# EAGLE design Bee Stem v0.9b (EAGLE 5.10)
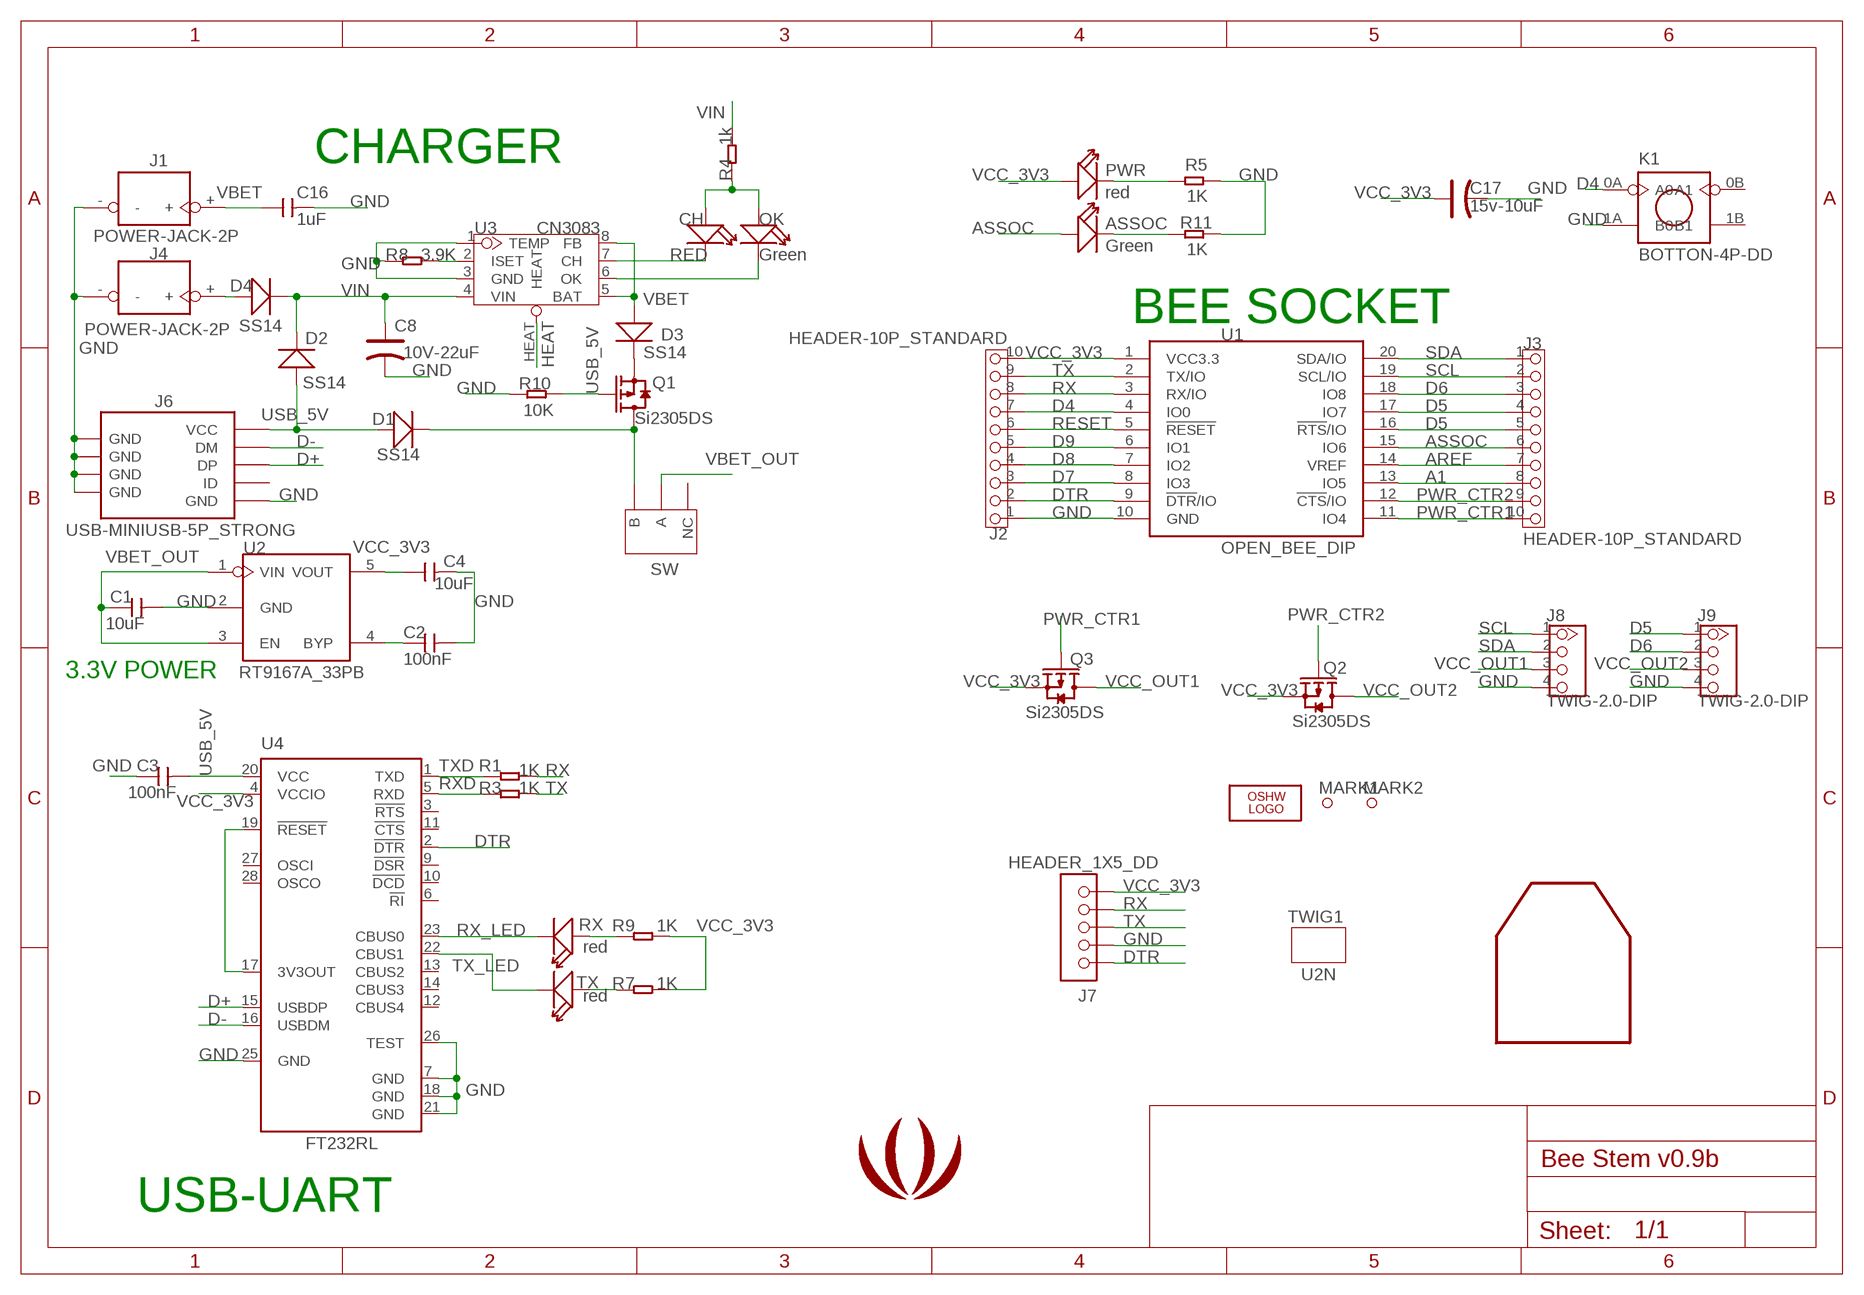
[diagram p0: schematic, sheet 1]

## Parts
ASSOC  Green  LED-0603  [D0603]
C1  10uF  C-0805  [0805]
C2  100nF  C-0603  [0603]
C3  100nF  C-0603  [0603]
C4  10uF  C-0805  [0805]
C8  10V-22uF  CAP_AVX_B  [AVX-B]
C16  1uF  C-0805  [0805]
C17  15v-10uF  CAP_AVX_A  [AVX-A]
CH  RED  LED-0603  [D0603]
D1  SS14  D-2010  [D2010]
D2  SS14  D-2010  [D2010]
D3  SS14  D-2010  [D2010]
D4  SS14  D-2010  [D2010]
J1  POWER-JACK-2P  JACK-2P_180  [POWER-JACK-2P]
J2  HEADER-10P_STANDARD  [2.54_10P]
J3  HEADER-10P_STANDARD  [2.54_10P]
J4  POWER-JACK-2P  JACK-2P_180  [POWER-JACK-2P]
J6  USB-MINIUSB-5P_STRONG  [MINI_STRONG]
J7  HEADER_1X5_DD  [CK_1X5]
J8  TWIG-2.0-DIP  [2.0_1X4]
J9  TWIG-2.0-DIP  [2.0_1X4]
K1  BOTTON-4P-DD  [BTN-S]
LOGO1  LOGO_SILK  [LOGO_SILK]
LOGO2  OSHW_LOGO_FILLX0200-NT  [OSHW_FILLX200_NOTEXT]
MARK1  PAD-MARK  [MARK]
MARK2  PAD-MARK  [MARK]
OK  Green  LED-0603  [D0603]
PWR  red  LED-0805  [D0805]
Q1  Si2305DS  010-P-MOSFETSOT23  [SOT23]
Q2  Si2305DS  010-P-MOSFETSOT23  [SOT23]
Q3  Si2305DS  010-P-MOSFETSOT23  [SOT23]
R1  1K  R-0603  [0603]
R3  1K  R-0603  [0603]
R4  1k  R-0603  [0603]
R5  1K  R-0603  [0603]
R7  1K  R-0603  [0603]
R8  3.9K  R-0603  [0603]
R9  1K  R-0603  [0603]
R10  10K  R-0603  [0603]
R11  1K  R-0603  [0603]
RX  red  LED-0603  [D0603]
SW  SWITCH-3P  [008-SW-3P-DIP]
TWIG1  U2N  [U2N_SILK]
TX  red  LED-0603  [D0603]
U1  OPEN_BEE_DIP  [CCBEE-PRO]
U2  RT9167A_33PB  RT9167A  [SOT23-5]
U3  CN3083  [SOP8]
U4  FT232RL  [SSOP28]
U$1  WIFI_SILK  [WIFI_SILK]

## Nets
A1: J3.8 U1.13(IO5)
AREF: J3.7 U1.14(VREF)
ASSOC: ASSOC.+ J3.6 U1.15(IO6)
D4: J2.7 K1.0A(A0) U1.4(IO0)
D5: J3.4 J3.5 J9.1 U1.16(!RTS!/IO) U1.17(IO7)
D6: J3.3 J9.2 U1.18(IO8)
D7: J2.3 U1.8(IO3)
D8: J2.4 U1.7(IO2)
D9: J2.5 U1.6(IO1)
D+: J6.3(DP) U4.15(USBDP)
D-: J6.2(DM) U4.16(USBDM)
DTR: J2.2 J7.1 U1.9(!DTR!/IO) U4.2(!DTR)
GND: C1.2 C2.2 C3.1 C4.2 C8.- C16.2 C17.- J1.- J2.1 J4.- J6.5(GND) J6.GND@1(GND) J6.GND@2(GND) J6.GND@3(GND) J6.GND@4(GND) J7.2 J8.4 J9.4 K1.1A(B0) R5.1 R8.1 R10.1 R11.1 U1.10(GND) U2.2(GND) U3.1(TEMP) U3.3(GND) U4.7(GND) U4.18(GND) U4.21(GND) U4.25(GND) U4.26(TEST)
HEAT: U3.HEAT
N$1: PWR.- R5.2
N$2: R8.2 U3.2(ISET)
N$3: D4.+ J4.+
N$6: C2.1 U2.4(BYP)
N$7: CH.- U3.7(CH)
N$8: OK.- U3.6(OK)
N$9: CH.+ OK.+ R4.1
N$10: U4.17(3V3OUT) U4.19(!RESET)
N$11: D3.- Q1.2(S)
N$12: ASSOC.- R11.2
N$13: D1.- Q1.3(D) SW.P$3(B)
N$15: R9.1 RX.+
N$16: R7.1 TX.+
PWR_CTR1: J3.10 Q3.1(G) U1.11(IO4)
PWR_CTR2: J3.9 Q2.1(G) U1.12(!CTS!/IO)
RESET: J2.6 U1.5(!RESET)
RX: J2.8 J7.4 R1.2 U1.3(RX/IO)
RX_LED: RX.- U4.23(CBUS0)
RXD: R3.1 U4.5(RXD)
SCL: J3.2 J8.1 U1.19(SCL/IO)
SDA: J3.1 J8.2 U1.20(SDA/IO)
TX: J2.9 J7.3 R3.2 U1.2(TX/IO)
TX_LED: TX.- U4.22(CBUS1)
TXD: R1.1 U4.1(TXD)
USB_5V: C3.2 D1.+ D2.+ J6.1(VCC) Q1.1(G) R10.2 U4.20(VCC)
VBET: C16.1 D3.+ J1.+ U3.5(BAT) U3.8(FB)
VBET_OUT: C1.1 SW.P$2(A) U2.1(VIN) U2.3(EN)
VCC_3V3: C4.1 C17.+ J2.10 J7.5 PWR.+ Q2.2(S) Q3.2(S) R7.2 R9.2 U1.1(VCC3.3) U2.5(VOUT) U4.4(VCCIO)
VCC_OUT1: J8.3 Q3.3(D)
VCC_OUT2: J9.3 Q2.3(D)
VIN: C8.+ D2.- D4.- R4.2 U3.4(VIN)
Unconnected: J6.4(ID) K1.0B(A1) K1.1B(B1) SW.P$1(NC) U4.3(!RTS) U4.6(!RI) U4.9(!DSR) U4.10(!DCD) U4.11(!CTS) U4.12(CBUS4) U4.13(CBUS2) U4.14(CBUS3) U4.27(OSCI) U4.28(OSCO)

## Notes on the sheet
- CHARGER
- BEE SOCKET
- 3.3V POWER
- USB-UART

## Library data of the parts
ASSOC CH OK PWR RX TX = Discrete:LED*
C1-C4 C16 = Discrete:C*: Ceramic Capacitors
C8 C17 = Discrete:CAP*: Electrolytic Capacitors,Tantalum Capacitors and Super Capacitors
D1-D4 = Discrete:D*
J1 J4 = Connector:JACK-2P
J2 J3 = Connector:HEADER-10P
J6 = Connector:USB-MINIUSB-5P
J7 = CONNECTER:HEADER_1X5
J8 J9 = Connector:TWIG-2.0-DIP
K1 = Discrete:BOTTON-4P
LOGO1 = logo:LOGO_SILK
LOGO2 = logo:OSHW_LOGO_FILL
MARK1 MARK2 = Discrete:PAD-MARK
Q1-Q3 = Discrete:010-P-MOSFET*: Si2305DS Si2323CDS
R1 R3-R5 R7-R11 = Discrete:R*
SW = Discrete:SWITCH-3P
TWIG1 = twig_template1:U2N
U1 = EXT_moudle:OPEN_BEE
U2 = IC:RT9167A: Voltage regulator
U3 = IC:CN3083
U4 = IC:FT232R: Source: http://www.ftdichip.com/Documents/DataSheets/DS_FT232R_v104.pdf
U$1 = seeedleo:WIFI_SILK

## Net classes
0 default: width 0.203 mm, drill 0.305 mm, clearance 0.127 mm

## Board
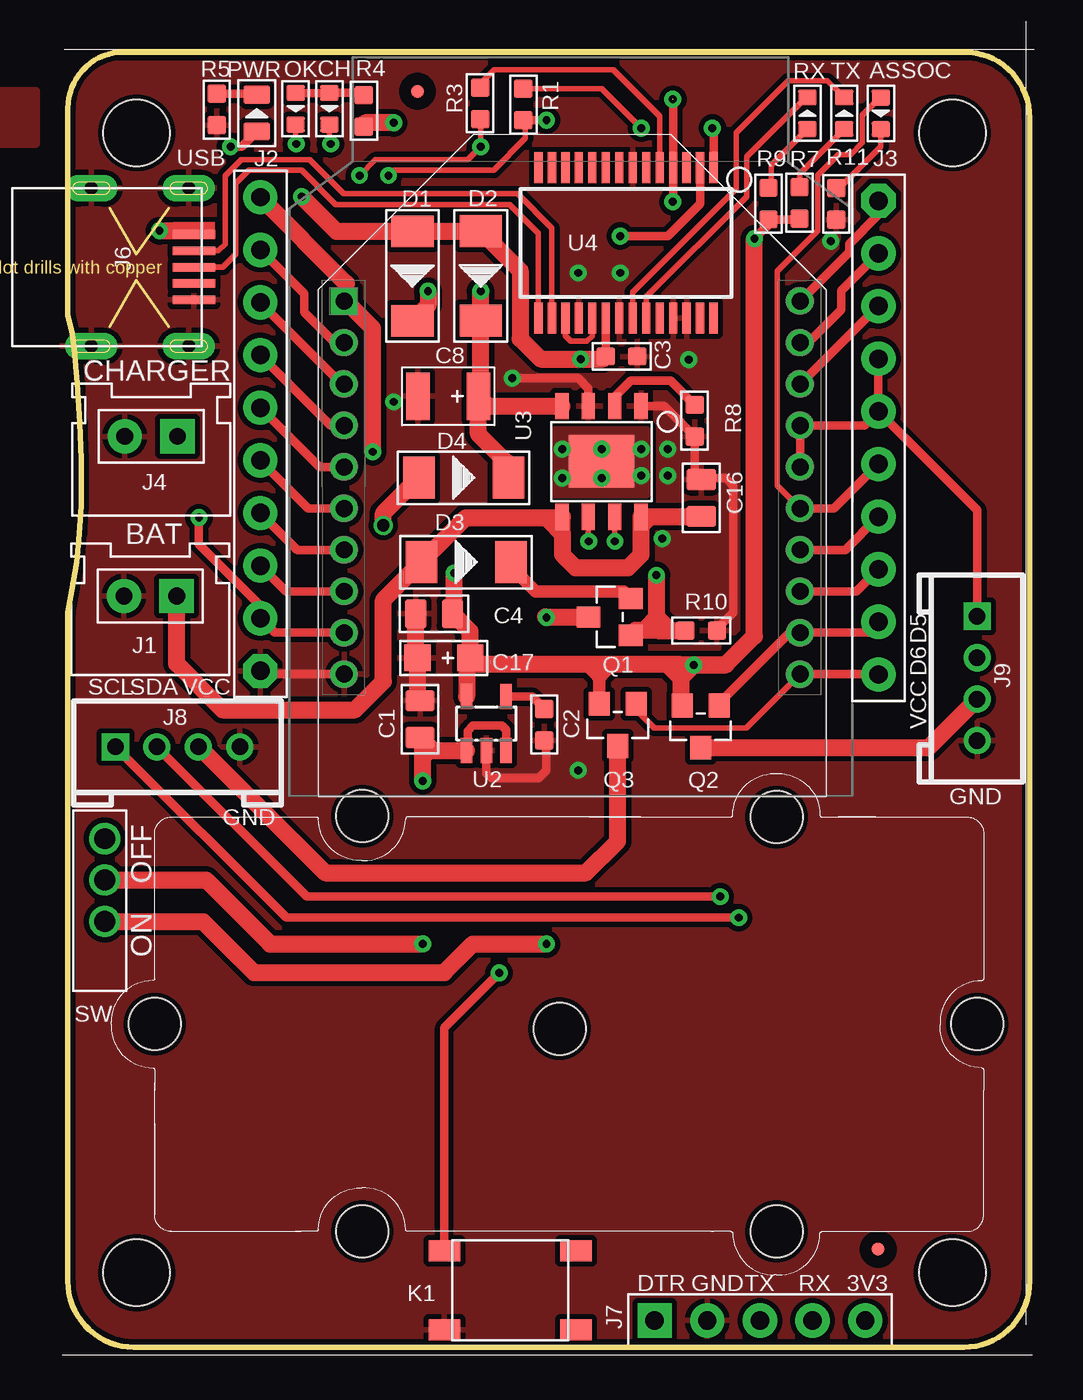
[diagram p1: board, top side]
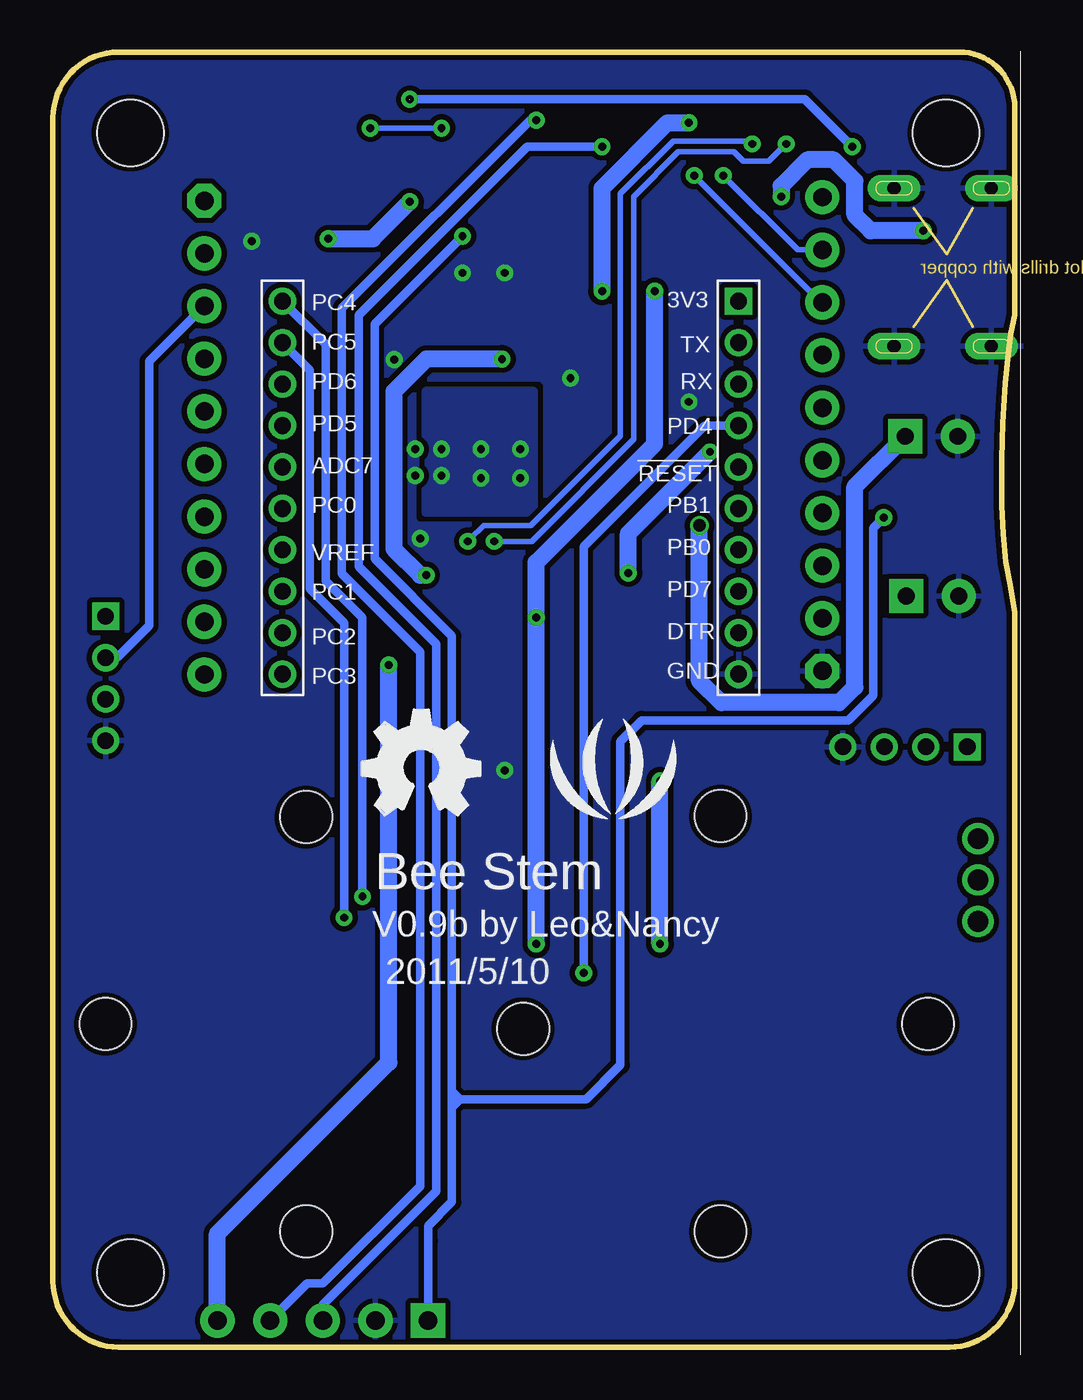
[diagram p2: board, bottom side, seen from below]

Size 46.48 x 62.53 mm. Coordinates in mm from the lower left corner, seen from the top.
Outline: 0.03,49.83 0.03,59.82 arc-90 2.73,62.53 43.25,62.53 arc-90 46.43,59.35 46.43,3.2 arc-90 43.25,0.03 3.2,0.03 arc-90 0.03,3.2 0.03,35.46 0.48,38.05 0.71,41.05 0.58,45.69 0.25,48.89 0.03,49.83
Outline: 46.48,59.46 arc67 43.79,62.53
Outline: 0,3.07 arc67 2.69,0
Outline: 43.38,0 arc67 46.46,2.69
Outline: 0.03,35.48 0.25,36.8 0.46,37.92 0.58,39.27 0.66,40.64 0.66,42.87 0.61,44.63 0.48,46.56 0.33,48.16 0.23,48.95 0.03,49.83
Copper layers (1*16): Top 0.035mm / dielectric 1.5mm / Bottom 0.035mm
Design rules "SeeedStudio_rule_no_angle_090911": minimum track width 6mil, minimum drill 12mil, track to track 6mil, track to pad 6mil, pad to pad 6mil, via to via 6mil, smd to smd 0mil, copper to edge 10mil, drill to drill 10mil, minimum pad ring 10mil, minimum via ring 6mil, stop-mask expansion 2mil, vias tented up to drill 100mil, thermal gap 10mil
Holes 3.2 mm at 42.69,58.62 42.69,3.62 3.35,3.62 3.35,58.62
Holes 2.5 mm at 43.89,15.62 14.22,25.65 34.21,25.6 23.75,15.39 14.22,5.61 4.22,15.62 34.21,5.61

### Footprints (pad centres in the part's own frame; a part is rotated, then mirrored left to right if it is on the bottom)
D0603 = smd 0.762 x 0.889: + -0.762,0; - 0.762,0
0805 = smd 1.016 x 1.397: 1 -0.889,0; 2 0.889,0
0603 = smd 0.889 x 0.889: 1 -0.762,0; 2 0.762,0
AVX-B = smd 1.143 x 2.286: + -1.46,0; - 1.46,0
AVX-A = smd 1.27 x 1.27: + -1.27,0; - 1.27,0
D2010 = smd 1.524 x 2.032: + -2.159,0; - 2.159,0
POWER-JACK-2P = drill 0.813 pad 1.651 square: + 1.27,0 | drill 0.813 pad 1.651 round: - -1.27,0
2.54_10P = drill 0.889 pad 1.651 octagon: 1 0,11.43 | drill 0.889 pad 1.651 round: 2 0,8.89; 3 0,6.35; 4 0,3.81; 5 0,1.27; 6 0,-1.27; 7 0,-3.81; 8 0,-6.35; 9 0,-8.89; 10 0,-11.43
MINI_STRONG = smd 2.032 x 0.406: 1 0.381,-1.575; 2 0.381,-0.787; 3 0.381,0; 4 0.381,0.787; 5 0.381,1.575 | drill 0.635 pad 1.27 long: GND@1 0.635,3.81; GND@2 5.334,3.81; GND@3 5.334,-3.81; GND@4 0.635,-3.81
CK_1X5 = drill 0.889 pad 1.651 square: 1 0,5.08 | drill 0.889 pad 1.651 round: 2 0,2.54; 3 0,0; 4 0,-2.54; 5 0,-5.08
2.0_1X4 = drill 0.8 pad 1.27 square: 1 -3,0 | drill 0.8 pad 1.27 round: 2 -1,0; 3 1,0; 4 3,0
BTN-S = smd 1.524 x 1.016: 0A -3.175,1.905; 0B 3.175,1.905; 1A -3.175,-1.905; 1B 3.175,-1.905
MARK = smd 0.635 x 0.635: P$1 0,0
D0805 = smd 0.889 x 1.27: + -0.889,0; - 0.889,0
SOT23 = smd 1.016 x 1.143: 1 -0.889,-1.016; 2 0.889,-1.016; 3 0,1.016
008-SW-3P-DIP = drill 1 pad 1.5 round: P$1 -3,0.24; P$2 -1,0.24; P$3 1,0.24
CCBEE-PRO = drill 0.813 square: 1 -11,9 | drill 0.813 round: 2 -11,7; 3 -11,5; 4 -11,3; 5 -11,1; 6 -11,-1; 7 -11,-3; 8 -11,-5; 9 -11,-7; 10 -11,-9; 11 11,-9; 12 11,-7; 13 11,-5; 14 11,-3; 15 11,-1; 16 11,1; 17 11,3; 18 11,5; 19 11,7; 20 11,9
SOT23-5 = smd 0.55 x 1.2: 1 -0.95,-1.3; 2 0,-1.3; 3 0.95,-1.3; 4 0.95,1.3; 5 -0.95,1.3
SOP8 = smd 0.635 x 1.27: 1 -1.905,-2.667; 2 -0.635,-2.667; 3 0.635,-2.667; 4 1.905,-2.667; 5 1.905,2.667; 6 0.635,2.667; 7 -0.635,2.667; 8 -1.905,2.667 | smd 3.175 x 2.54: HEAT 0,0
SSOP28 = smd 0.4 x 1.5: 1 -4.225,-3.625; 2 -3.575,-3.625; 3 -2.925,-3.625; 4 -2.275,-3.625; 5 -1.625,-3.625; 6 -0.975,-3.625; 7 -0.325,-3.625; 8 0.325,-3.625; 9 0.975,-3.625; 10 1.625,-3.625; 11 2.275,-3.625; 12 2.925,-3.625; 13 3.575,-3.625; 14 4.225,-3.625; 15 4.225,3.625; 16 3.575,3.625; 17 2.925,3.625; 18 2.275,3.625; 19 1.625,3.625; 20 0.975,3.625; 21 0.325,3.625; 22 -0.325,3.625; 23 -0.975,3.625; 24 -1.625,3.625; 25 -2.275,3.625; 26 -2.925,3.625; 27 -3.575,3.625; 28 -4.225,3.625

### Placement (x,y rotation side)
ASSOC  39.24,59.56 270 top
C1  17.01,30.33 90 top
C2  23.01,30.07 270 top
C3  26.74,47.84 180 top
C4  17.7,35.42 180 top
C8  18.37,45.91 180 top
C16  30.58,41 90 top
C17  18.16,33.29 180 top
CH  12.64,59.79 270 top
D1  16.65,51.72 270 top
D2  19.94,51.72 270 top
D3  19.24,37.91 0 top
D4  19.12,41.98 0 top
J1  4,36.27 0 top
J2  9.31,44.09 180 top
J3  39.13,43.91 0 top
J4  4.04,43.97 0 top
J6  6.49,52.14 180 top
J7  33.41,1.32 90 top
J8  5.32,29 0 top
J9  43.89,32.29 270 top
K1  21.36,2.77 0 top
LOGO1  19.42,27.19 0 bottom
LOGO2  31.5,25.7 0 bottom
MARK1  39.12,4.75 0 top
MARK2  16.89,60.63 0 top
OK  11.01,59.78 270 top
PWR  9.14,59.58 90 top
Q1  26.16,35.27 90 top
Q2  30.55,29.97 180 top
Q3  26.55,30.05 180 top
R1  22,59.99 270 top
R3  19.91,60.05 270 top
R4  14.31,59.68 270 top
R5  7.21,59.75 90 top
R7  35.32,55.24 270 top
R8  30.26,44.73 90 top
R9  33.82,55.21 270 top
R10  30.57,34.61 180 top
R11  37.09,55.19 90 top
RX  35.7,59.57 90 top
SW  1.56,21.57 270 top
TWIG1  24.38,15.39 0 top
TX  37.47,59.57 90 top
U1  24.36,41.5 0 top
U2  20.21,30.12 0 top
U3  25.77,42.77 180 top
U4  26.95,53.31 180 top
U$1  24.48,41.17 0 top

### Tracks (layer width: path | path; a pad name or v marks a point on that pad's centre or on a via)
A1
  Top 0.406: U1.13 38.06,36.5 J3.8
AREF
  Top 0.406: U1.14 37.52,38.5 J3.7
ASSOC
  Top 0.254: ASSOC.+ 39.19,60.32 38.35,59.49 38.35,58.15 37.79,57.58 37.19,57.58 36.2,56.59 36.2,53.9 34.25,51.95 34.25,41.61 U1.15
  Top 0.406: U1.15 36.98,40.5 J3.6
D4  (via drill 0.38 pad 0.81)
  Top 0.406: U1.4 12.71,44.5 J2.7 | K1.0A 18.18,15.44 v20.83,18.08
  Bottom 0.406: v20.83,18.08 20.83,38.66 14.99,44.5 U1.4
D5
  Top 0.406: J9.1 43.89,40.42 J3.5 | U1.16 U1.17 38.44,44.5 J3.5 | J3.5 J3.4
D6
  Top 0.406: U1.18 J3.3
  Bottom 0.406: J9.2 43.34,33.29 41.78,34.85 41.78,47.61 J3.3
D7
  Top 0.406: U1.8 10.55,36.5 J2.3
D8
  Top 0.406: U1.7 11.09,38.5 J2.4
D9
  Top 0.406: U1.6 11.63,40.5 J2.5
D+
  Top 0.254: J6.3 7.51,52.14 8.13,52.76 8.13,56.18 8.76,56.82 11.3,56.82 12.95,55.17 21.34,55.17 22.72,53.78 U4.15
D-
  Top 0.254: J6.2 7.28,52.93 7.62,53.26 7.62,56.57 8.38,57.33 11.68,57.33 13.34,55.68 21.72,55.68 23.37,54.02 U4.16
DTR  (via drill 0.38 pad 0.81)
  Top 0.406: U1.9 10.01,34.5 J2.2 9.31,35.82 6.35,38.79 v6.35,40.06 | v26.67,53.64 28.96,53.64 30.52,55.21 U4.2
  Bottom 0.406: J7.1 28.33,5.13 28.32,5.14 28.32,5.89 27.18,7.04 27.18,11.61 | 27.18,11.61 27.18,11.99 | 27.18,11.99 27.18,12.37 | 27.18,12.37 27.18,34.34 30.91,38.07 30.91,49.4 v26.67,53.64 | 27.18,11.99 26.8,11.99 | 26.8,11.99 20.7,11.99 19.05,13.64 19.05,29.26 18.03,30.28 8.06,30.28 6.86,31.47 6.86,39.55 v6.35,40.06 | 26.8,11.99 27.18,12.37 | 27.18,11.61 26.8,11.99
GND  (via drill 0.38 pad 0.81)
  Top 0.406: U1.10 9.47,32.5 J2.1 | U2.2 20.21,27.72 20.45,27.48 22.73,27.48 23.11,27.86 23.11,29.2 C2.2 | R10.1 31.34,34.69 32.13,35.48 32.13,41.58 31.75,41.96 30.65,41.96 C16.2 30.26,42.21 R8.1 28.8,45.43 U3.1 | U3.3 25.13,46.29 24.64,46.79 v21.46,46.79
  Top 0.813: C4.2 16.81,33.37 C17.- 16.89,31.34 C1.2
  other vias: 15.75,45.64 29.97,47.68 26.67,51.87 28.7,39.04 24.64,27.86 24.64,51.87 28.96,42.09 28.96,43.36 36.83,53.39
  pour Top: -3.43,60.63 -1.52,60.63 -1.52,58.09 -3.43,58.09
  pour Top (isolate 0.254, rank 2): -0.25,62.66 46.61,62.66 46.61,-0.46 -0.25,-0.46
  pour Bottom (isolate 0.254, rank 2): -0.25,62.66 46.61,62.66 46.61,-0.46 -0.25,-0.46
HEAT  (via drill 0.38 pad 0.81)
  other vias: 23.88,43.36 23.88,41.96 25.78,43.36 27.69,43.36 27.69,42.09 25.78,41.96
  pour Top (isolate 0.254, no thermals): 23.49,44.25 27.94,44.25 27.94,41.2 23.49,41.2
  pour Bottom (isolate 0.254): 23.49,46.15 28.45,46.15 28.45,40.31 23.24,40.31 23.24,46.15
N$1
  Top 0.406: R5.2 9.1,60.51 PWR.-
N$2
  Top 0.406: U3.2 26.4,45.88 27.18,46.66 29.1,46.66 R8.2
N$3  (via drill 0.6)
  Top 0.813: v15.24,39.67 15.24,40.27 D4.+
  Bottom 0.813: v15.24,39.67 15.24,32.18 14.18,31.12 8.5,31.12 7.75,31.88 7.75,41.54 J4.+
N$6
  Top 0.406: U2.4 22.42,31.42 C2.1
N$7  (via drill 0.38 pad 0.81)
  Top 0.254: U3.7 26.4,38.93 v26.42,38.91 | CH.- 12.64,58.15 v12.7,58.09
  Bottom 0.254: v26.42,38.91 26.42,39.04 26.29,39.04 25.65,39.67 23.37,39.67 19.05,43.99 19.05,55.68 16.51,58.22 12.83,58.22 v12.7,58.09
N$8  (via drill 0.38 pad 0.81)
  Top 0.254: U3.6 25.13,38.93 v25.15,38.91 | OK.- 11.01,58.12 v11.05,58.09
  Bottom 0.254: v25.15,38.91 23.34,38.91 18.41,43.84 18.41,55.55 16.26,57.71 13.59,57.71 13.13,57.25 11.89,57.25 v11.05,58.09
N$9
  Top 0.406: OK.+ CH.+ 14.2,60.55 R4.1
N$10
  Top 0.254: U4.19 25.32,48.82 25.06,48.56 24.29,48.56 24.02,48.83 U4.17
N$11
  Top 0.61: D3.- 21.4,37.71 22.61,36.5 26.84,36.5 Q1.2
N$12
  Top 0.254: R11.2 37.24,55.96 39.24,57.96 ASSOC.-
N$13  (via drill 0.38 pad 0.81)
  Top 0.813: Q1.3 23.08,35.27 v23.11,35.23 | D1.- 17.4,50.31 v17.4,50.98 | SW.P$3 6.53,20.57 9,18.11 18.18,18.11 19.56,19.48 v23.11,19.48
  Bottom 0.813: v23.11,19.48 v23.11,35.23 23.11,37.9 17.4,43.61 v17.4,50.98
N$15
  Top 0.254: RX.+ 33.95,57.05 33.95,56.1 R9.1
N$16
  Top 0.254: R7.1 35.32,56.66 TX.+
PWR_CTR1
  Top 0.254: Q3.1 27.44,30.77 28.32,29.9 32.75,29.9 U1.11
  Top 0.406: U1.11 39.11,32.5 J3.10
PWR_CTR2
  Top 0.406: J3.9 38.6,34.5 U1.12 35.32,34.47 34.8,34.47 31.44,31.11 Q2.1
RESET
  Top 0.406: U1.5 12.17,42.5 J2.6
RX  (via drill 0.38 pad 0.81)
  Top 0.254: v15.49,56.57 15.75,56.82 20.56,56.82 22.1,58.35 22.1,59.13 R1.2
  Top 0.406: U1.3 13.25,46.5 J2.8 | v23.11,59.23 R1.2
  Bottom 0.254: J2.8 9.37,50.44 v15.49,56.57
  Bottom 0.406: J7.4 34.17,3.1 33.4,3.1 28.7,7.8 28.7,33.58 32.49,37.36 32.49,50.16 23.41,59.23 v23.11,59.23
RX_LED
  Top 0.254: RX.- 35.66,60.38 32.77,57.48 32.77,55.55 27.92,50.71 U4.23
RXD
  Top 0.254: R3.1 19.91,60.99 20.59,61.66 26.34,61.66 28.57,59.43 U4.5
SCL  (via drill 0.38 pad 0.81)
  Top 0.406: U1.19 35.75,48.5 37.34,50.09 37.34,51.02 J3.2 | J8.1 10.57,20.75 v32.39,20.75
  Bottom 0.406: v32.39,20.75 32.39,34.98 34.04,36.63 34.04,47.18 U1.19
SDA  (via drill 0.38 pad 0.81)
  Top 0.406: J8.2 11.55,21.77 v31.5,21.77 | J3.1 39.13,54.67 37.72,53.26 37.72,52.86 U1.20
  Bottom 0.406: v31.5,21.77 31.5,35.23 33.27,37.01 33.27,48.42 U1.20
TX  (via drill 0.38 pad 0.81)
  Top 0.254: v14.1,56.57 14.86,57.33 19.3,57.33 v19.94,57.96 19.94,59.26 R3.2
  Top 0.406: U1.2 12.89,48.5 11.43,49.96 11.43,50.86 J2.9
  Bottom 0.254: J2.9 10.51,52.98 v14.1,56.57
  Bottom 0.406: J7.3 33.41,2.07 27.94,7.54 27.94,33.96 31.68,37.7 31.68,49.83 23.55,57.96 v19.94,57.96
TX_LED
  Top 0.254: TX.- 36.67,61.14 34.77,61.14 32.26,58.62 32.26,55.93 27.27,50.95 U4.22
TXD  (via drill 0.38 pad 0.81)
  Top 0.254: R1.1 25.79,60.75 v27.69,58.85
  Top 0.406: U4.1 31.17,58.79 v31.11,58.85
  Bottom 0.254: v27.69,58.85 v31.11,58.85
USB_5V  (via drill 0.38 pad 0.81)
  Top 0.305: J6.1 6.03,53.71 5.84,53.9
  Top 0.406: U4.20 C3.2
  Top 0.813: v11.3,55.55 12.98,53.88 D1.+ D2.+ 21.84,51.98 21.84,48.69 22.83,47.71 v24.76,47.71 25.85,47.71 C3.2 | 28.45,34.61 27.41,34.61 Q1.1 | 28.45,34.61 R10.2 | 28.45,34.61 28.42,34.64 28.42,35.2 | v28.42,37.28 28.42,35.2 | 28.42,35.2 27.94,34.72 28.96,34.72 28.57,35.1 | v4.45,53.9 5.84,53.9
  Bottom 0.813: v11.3,55.55 11.3,56.06 10.03,57.33 8.76,57.33 7.75,56.31 7.75,54.66 6.98,53.9 v4.45,53.9 | v28.42,37.28 28.72,37.28 29.98,38.54 29.98,46.14 28.41,47.71 v24.76,47.71
VBET
  Top 0.813: J1.+ 5.27,33.01 7.49,30.78 13.87,30.78 15.24,32.16 15.24,36.07 D3.+ | 23.88,39.29 23.88,40.09 U3.5 23.82,40.06 23.24,40.06 | 23.88,39.29 23.88,38.28 24.51,37.64 27.05,37.64 27.67,38.26 U3.8 28.11,40.1 | D3.+ 16.83,38.15 | D3.+ 19.23,40.06 23.24,40.06 | C16.1 30.56,40.1 28.17,40.1 28.11,40.1 | 23.24,40.06 23.24,39.93 23.88,39.29 | 28.11,40.1 27.69,39.67
VBET_OUT  (via drill 0.38 pad 0.81)
  Top 0.406: U2.3 21.16,29.82 20.95,30.02 19.56,30.02 19.3,29.77 19.3,28.86 U2.1
  Top 0.813: U2.1 17.64,28.82 C1.1 17.14,29.31 17.14,28.5 | SW.P$2 6.69,22.57 9.78,19.48 v17.14,19.48 | v17.14,27.36 17.14,28.29 17.14,28.5 | 17.14,28.5 17.53,28.88
  Bottom 0.813: v17.14,19.48 v17.14,27.36
VCC_3V3  (via drill 0.38 pad 0.81)  (1 unrouted)
  Top 0.406: v33.15,53.52 33.95,54.32 R9.2 35.27,54.45 | v7.87,57.96 8.42,57.96 PWR.+ | 35.27,54.45 35.31,54.41 | 35.29,54.45 35.41,54.45 | 35.27,54.45 35.29,54.45 | 35.29,54.45 R7.2 | 29.22,60.23 U4.4 29.22,55.31 v29.21,55.3
  Top 0.61: 25.66,32.41 25.66,32.83 25.53,32.97 | 25.66,32.41 Q3.2 | 25.66,32.41 25.55,32.41 25.15,32.82 | 25.66,32.41 25.75,32.41 26.16,32.82
  Top 0.813: 19.26,32.97 U2.5 | 19.26,32.97 19.26,33.11 C17.+ 19.43,34.57 C4.1 18.67,35.5 v18.67,37.39 | 19.26,32.97 25.53,32.97 29.59,32.97 | Q2.2 29.59,31.06 29.59,32.31 | 31.77,32.97 31.75,32.94 v30.23,32.94 29.59,32.31 | v33.15,53.52 33.15,34.34 31.77,32.97 | v14.73,43.23 14.73,49.2 13.43,50.5 U1.1 13.46,50.61 13.46,51.36 J2.10 | 29.59,32.97 31.77,32.97 | 29.59,32.31 29.59,32.97 | 29.59,32.31 28.96,32.94
  Bottom 0.406: v29.21,60.25 10.16,60.25 v7.87,57.96
  Bottom 0.813: v14.73,43.23 18.67,39.29 v18.67,37.39 | J7.5 38.49,5.5 30.23,13.77 v30.23,32.94 | v33.15,53.52 30.99,53.52 v29.21,55.3
VCC_OUT1
  Top 0.813: J8.3 6.36,29 12.45,22.91 25.02,22.91 26.54,24.43 26.54,29.03 Q3.3
VCC_OUT2
  Top 0.813: J9.3 42.2,29.61 41.8,29.21 41.55,28.96 Q2.3
VIN  (via drill 0.38 pad 0.81)
  Top 0.813: D4.- 21.21,42.05 21.21,42.72 19.83,44.1 C8.+ | D2.- v19.94,50.98 | D2.- | D2.- 19.94,46.02 C8.+ | U3.4 20.31,45.43 C8.+ | v15.75,59.11 14.38,59.11 14.3,59.03 R4.2
  Bottom 0.813: v19.94,50.98 19.94,55.95 16.78,59.11 v15.75,59.11
(copper drawn outside any net)
  shapes: Top area x1

### Text on the board
tPlace: USB | CHARGER | BAT | D5 | SCL | SDA | VCC | D6 | VCC | GND | GND | OFF | ON | DTR | GND | TX | RX | 3V3
bPlace: 3V3 | PC4 | TX | PC5 | RX | PD6 | PD5 | PD4 | ADC7 | RESET | PB1 | PC0 | PB0 | VREF | PD7 | PC1 | DTR | PC2 | GND | PC3 | Bee Stem | V0.9b by Leo&Nancy | 2011/5/10